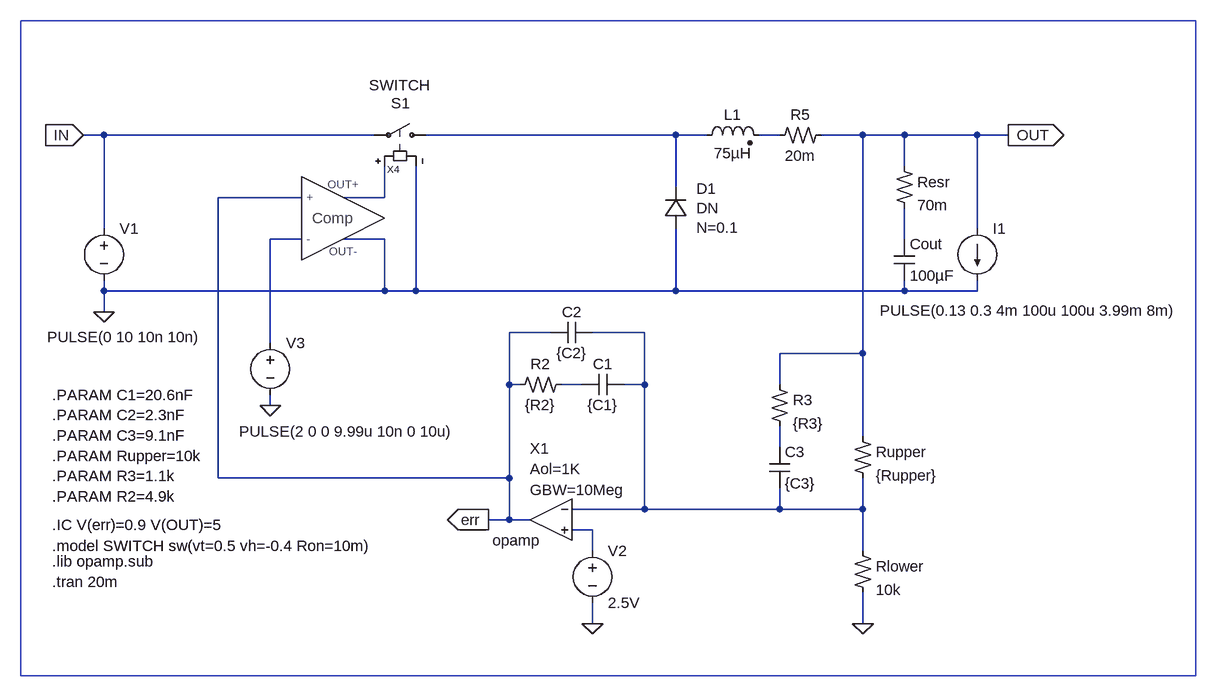
[diagram p0: schematic Switch-Mode Power Supplies - Basso- Figure 2-49.asc]
Switch-Mode Power Supplies - Basso- Figure 2-49.asc, the LTspice schematic file:
Version 4
SHEET 1 1684 1876
WIRE -352 48 -384 48
WIRE 64 48 -352 48
WIRE 528 48 144 48
WIRE 576 48 528 48
WIRE 688 48 656 48
WIRE 816 48 752 48
WIRE 880 48 816 48
WIRE 992 48 880 48
WIRE 1040 48 992 48
WIRE 880 96 880 48
WIRE 528 128 528 48
WIRE -48 144 -176 144
WIRE 80 144 80 96
WIRE 80 144 16 144
WIRE -352 192 -352 48
WIRE 992 192 992 48
WIRE -48 208 -96 208
WIRE 80 208 16 208
WIRE 880 208 880 160
WIRE -352 288 -352 272
WIRE 80 288 80 208
WIRE 80 288 -352 288
WIRE 128 288 128 96
WIRE 128 288 80 288
WIRE 528 288 528 192
WIRE 528 288 128 288
WIRE 880 288 880 272
WIRE 880 288 528 288
WIRE 992 288 992 272
WIRE 992 288 880 288
WIRE -352 320 -352 288
WIRE 336 352 272 352
WIRE 480 352 400 352
WIRE -96 368 -96 208
WIRE 816 384 816 48
WIRE 816 384 688 384
WIRE 272 432 272 352
WIRE 288 432 272 432
WIRE 384 432 352 432
WIRE 480 432 480 352
WIRE 480 432 448 432
WIRE 688 432 688 384
WIRE -96 464 -96 448
WIRE 816 512 816 384
WIRE 688 528 688 496
WIRE -176 576 -176 144
WIRE 272 576 272 432
WIRE 272 576 -176 576
WIRE 480 624 480 432
WIRE 480 624 368 624
WIRE 688 624 688 592
WIRE 688 624 480 624
WIRE 816 624 816 576
WIRE 816 624 688 624
WIRE 272 640 272 576
WIRE 272 640 240 640
WIRE 304 640 272 640
WIRE 400 656 368 656
WIRE 400 688 400 656
WIRE 816 688 816 624
WIRE 400 800 400 768
WIRE 816 800 816 752
FLAG -352 320 0
FLAG 1040 48 OUT
IOPIN 1040 48 Out
FLAG -384 48 IN
IOPIN -384 48 In
FLAG 240 640 err
IOPIN 240 640 Out
FLAG 400 800 0
FLAG 816 800 0
FLAG -96 464 0
SYMBOL ind2 560 64 R270
WINDOW 0 32 56 VTop 0
WINDOW 3 4 56 VBottom 0
SYMATTR InstName L1
SYMATTR Value 75µH
SYMBOL res2 864 96 R0
SYMATTR InstName Resr
SYMATTR Value 70m
SYMBOL cap 864 208 R0
SYMATTR InstName Cout
SYMATTR Value 100µF
SYMBOL Opamps\\opamp 336 576 M0
WINDOW 0 32 -46 Right 0
WINDOW 39 32 -14 Right 0
WINDOW 40 32 18 Right 0
SYMATTR InstName X1
SYMATTR SpiceLine Aol=1K
SYMBOL voltage -352 176 R0
WINDOW 123 0 0 Left 0
WINDOW 39 0 0 Left 0
WINDOW 3 -87 183 Left 0
SYMATTR InstName V1
SYMATTR Value PULSE(0 10 10n 10n)
SYMBOL res2 352 416 R90
WINDOW 0 0 32 VBottom 0
WINDOW 3 32 32 VTop 0
SYMATTR InstName R2
SYMATTR Value {R2}
SYMBOL cap 448 416 R90
WINDOW 0 0 32 VBottom 0
WINDOW 3 32 32 VTop 0
SYMATTR InstName C1
SYMATTR Value {C1}
SYMBOL cap 400 336 R90
WINDOW 0 0 32 VBottom 0
WINDOW 3 32 32 VTop 0
SYMATTR InstName C2
SYMATTR Value {C2}
SYMBOL voltage 400 672 R0
WINDOW 123 0 0 Left 0
WINDOW 39 0 0 Left 0
SYMATTR InstName V2
SYMATTR Value 2.5V
SYMBOL res2 752 32 R90
WINDOW 0 0 32 VBottom 0
WINDOW 3 32 32 VTop 0
SYMATTR InstName R5
SYMATTR Value 20m
SYMBOL res2 800 688 R0
SYMATTR InstName Rlower
SYMATTR Value 10k
SYMBOL res2 800 512 R0
SYMATTR InstName Rupper
SYMATTR Value {Rupper}
SYMBOL res2 672 432 R0
SYMATTR InstName R3
SYMATTR Value {R3}
SYMBOL cap 672 528 R0
SYMATTR InstName C3
SYMATTR Value {C3}
SYMBOL current 992 192 R0
WINDOW 123 0 0 Left 0
WINDOW 39 0 0 Left 0
WINDOW 3 -150 126 Left 0
SYMATTR Value PULSE(0.13 0.3 4m 100u 100u 3.99m 8m)
SYMATTR InstName I1
SYMBOL Comp 16 176 R0
SYMATTR InstName X4
SYMBOL D 528 160 M180
WINDOW 0 32 30 Left 0
WINDOW 38 32 0 Left 0
WINDOW 3 32 -30 Left 0
SYMATTR InstName D1
SYMATTR SpiceModel DN
SYMATTR Value N=0.1
SYMBOL voltage -96 352 R0
WINDOW 3 -48 152 Left 0
WINDOW 123 0 0 Left 0
WINDOW 39 0 0 Left 0
SYMATTR Value PULSE(2 0 0 9.99u 10n 0 10u)
SYMATTR InstName V3
SYMBOL sw 160 48 M270
WINDOW 0 49 70 VLeft 0
WINDOW 3 77 104 VLeft 0
SYMATTR InstName S1
SYMATTR Value SWITCH
TEXT -432 736 Left 0 !.tran 20m
TEXT -432 448 Left 0 !.PARAM C1=20.6nF\n.PARAM C2=2.3nF\n.PARAM C3=9.1nF\n.PARAM Rupper=10k\n.PARAM R3=1.1k\n.PARAM R2=4.9k
TEXT -432 704 Left 0 !.lib opamp.sub
TEXT -432 680 Left 0 !.model SWITCH sw(vt=0.5 vh=-0.4 Ron=10m)
TEXT -432 648 Left 0 !.IC V(err)=0.9 V(OUT)=5
RECTANGLE Normal 1328 880 -480 -128

The netlist it stands for:
* Switch-Mode Power Supplies - Basso- Figure 2-49.asc
L1 N001 N002 75µH
Resr OUT N005 70m
Cout N005 0 100µF
XX1 N006 N009 err opamp Aol=1K GBW=10Meg  ; pins invin noninvin out
V1 IN 0 PULSE(0 10 10n 10n)
R2 N007 err {R2}
C1 N006 N007 {C1}
C2 N006 err {C2}
V2 N009 0 2.5V
R5 OUT N002 20m
Rlower N006 0 10k
Rupper OUT N006 {Rupper}
R3 OUT N008 {R3}
C3 N008 N006 {C3}
I1 OUT 0 PULSE(0.13 0.3 4m 100u 100u 3.99m 8m)
XX4 err N004 N003 0 Comp  ; pins + - OUT+ OUT-
XD1 0 N001 DN N=0.1  ; pins + -
V3 N004 0 PULSE(2 0 0 9.99u 10n 0 10u)
S1 N001 IN N003 0 SWITCH
.tran 20m
.PARAM C1=20.6nF
.PARAM C2=2.3nF
.PARAM C3=9.1nF
.PARAM Rupper=10k
.PARAM R3=1.1k
.PARAM R2=4.9k
.lib opamp.sub
.model SWITCH sw(vt=0.5 vh=-0.4 Ron=10m)
.IC V(err)=0.9 V(OUT)=5
.lib D.lib
.backanno
.end